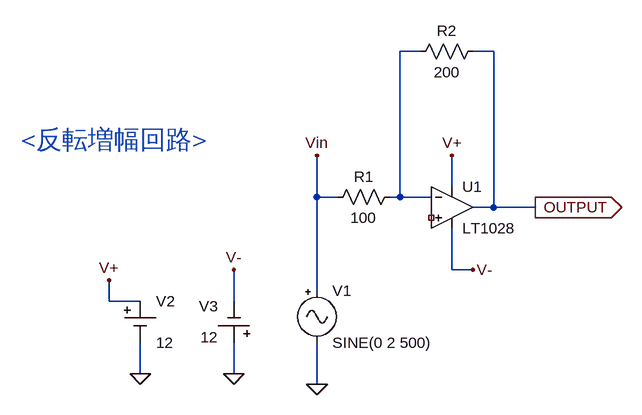
[diagram p0: schematic 25.1_1.(1).asc]
25.1_1.(1).asc, the LTspice schematic file:
Version 4
SHEET 1 880 680
WIRE 80 -128 48 -128
WIRE 192 -128 160 -128
WIRE 128 80 128 32
WIRE -80 96 -80 32
WIRE -48 96 -80 96
WIRE 48 96 48 -128
WIRE 48 96 32 96
WIRE 96 96 48 96
WIRE 192 112 192 -128
WIRE 192 112 160 112
WIRE 256 112 192 112
WIRE 128 208 128 144
WIRE 160 208 128 208
WIRE -80 240 -80 96
WIRE -400 256 -400 224
WIRE -352 256 -400 256
WIRE -208 256 -208 208
WIRE -352 368 -352 320
WIRE -208 368 -208 320
WIRE -80 384 -80 320
FLAG -352 368 0
FLAG -208 368 0
FLAG -80 384 0
FLAG -80 32 Vin
FLAG 256 112 OUTPUT
IOPIN 256 112 Out
FLAG -400 224 V+
FLAG -208 208 V-
FLAG 160 208 V-
FLAG 128 32 V+
SYMBOL Opamps\\LT1028 128 48 R0
SYMATTR InstName U1
SYMBOL res 48 80 R90
WINDOW 0 0 56 VBottom 2
WINDOW 3 32 56 VTop 2
SYMATTR InstName R1
SYMATTR Value 100
SYMBOL res 176 -144 R90
WINDOW 0 0 56 VBottom 2
WINDOW 3 32 56 VTop 2
SYMATTR InstName R2
SYMATTR Value 200
SYMBOL Misc\\signal -80 224 R0
WINDOW 123 0 0 Left 2
WINDOW 39 0 0 Left 2
SYMATTR InstName V1
SYMATTR Value SINE(0 2 500)
SYMBOL Misc\\cell -352 256 R0
WINDOW 123 0 0 Left 2
WINDOW 39 0 0 Left 2
SYMATTR InstName V2
SYMATTR Value 12
SYMBOL Misc\\cell -208 320 R180
WINDOW 0 24 56 Left 2
WINDOW 3 24 8 Left 2
WINDOW 123 0 0 Left 2
WINDOW 39 0 0 Left 2
SYMATTR InstName V3
SYMATTR Value 12
TEXT -536 8 Left 4 ;<反転増幅回路>

The netlist it stands for:
* 25.1_1.(1).asc
XU1 NC_01 N001 V+ V- OUTPUT LT1028  ; pins In+ In- V+ V- OUT
R1 N001 Vin 100
R2 OUTPUT N001 200
V1 Vin 0 SINE(0 2 500)
V2 V+ 0 12
V3 0 V- 12
* <反転増幅回路>
.lib LTC.lib
.backanno
.end